# Altium schematic sheet 93.HW_ID.SchDoc
size 297 x 209 mm; Revision: V2.1; Schematic Page Number: 11; Page Number: 40; Check: Default; Schematic Name: RK_NVR_DEMO1_RK3588_LP4/4x_V21; Page Count: 43; Page name: 93.HW_ID; Designer: Zhangdz; Schematic Page Count: 99; Revcode: V2.1; DsnPath: E:\Work\SBER\RK3588_SOM\temp\RK_NVR_DEMO1_RK3588_LP4XD200P232SD8_V21_20211228.DSN; SchematicName: RK_NVR_DEMO1_RK3588_LP4/4x_V21; PageName: 93.HW_ID; PageSize: A4; TopSchematic: True
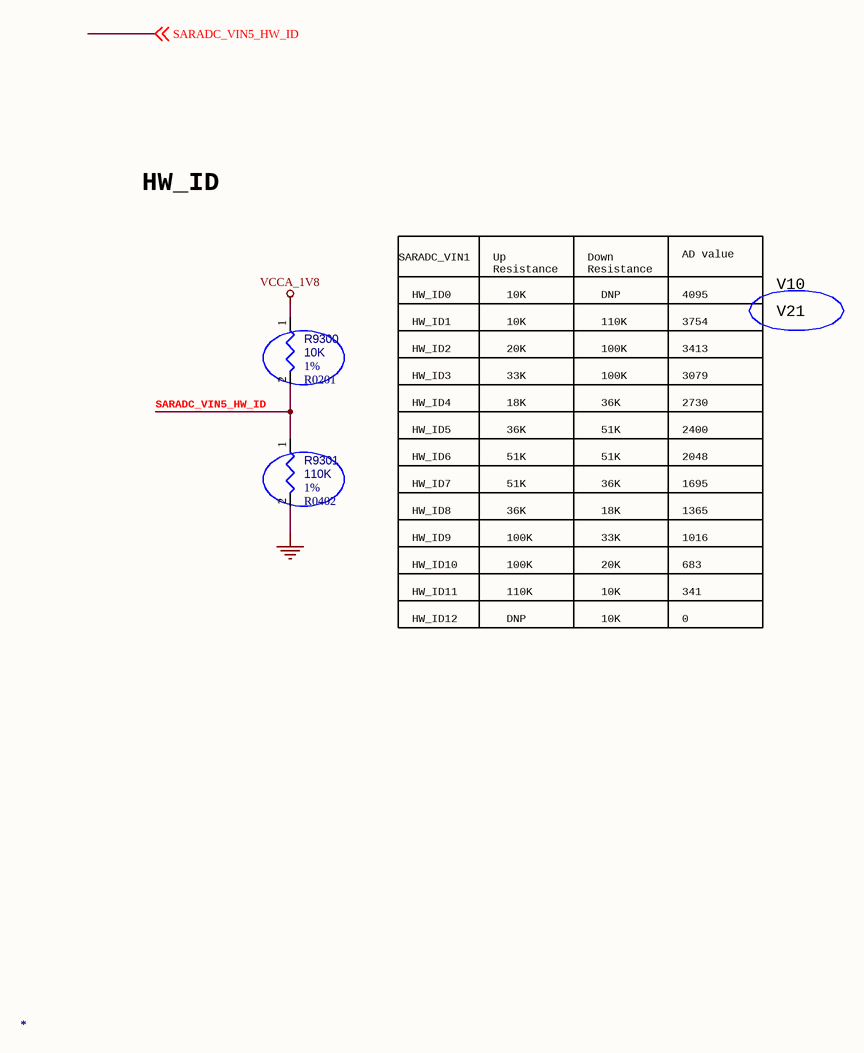
[diagram p0: 93.HW_ID.SchDoc]

## Parts
R9300  *  PCB Footprint: R0201  Tolerance: 1%  [R0402]
R9301  *  Tolerance: 1%  [R0402]

## Nets
GND: R9301.2
VCCA_1V8: R9300.1
SARADC_VIN5_HW_ID: R9300.2 R9301.1 ; off-sheet SARADC_VIN5_HW_ID

## Notes on the sheet
- HW_ID
- SARADC_VIN1
- HW_ID0
- Up
  Resistance
- 10K
- Down
  Resistance
- DNP
- AD value
- 4095
- V10
- V21
- HW_ID1
- HW_ID2
- HW_ID3
- 20K
- 33K
- 110K
- 100K
- 3413
- 3079
- 3754
- HW_ID4
- HW_ID5
- 18K
- 36K
- 51K
- 2730
- 2400
- HW_ID8
- HW_ID7
- HW_ID6
- 2048
- 1695
- 1365
- HW_ID10
- HW_ID9
- 1016
- 683
- HW_ID11
- HW_ID12
- 341
- 0

## Library data of the parts
R9300 = RESISTOR_Dup1: НЁУГєсД¤µзЧи,10K,+/-1%,R0201,1/20W.; Part Reference: R9300; Manufacturer PN: RC0201FR-0710KL; Manufacturer: YAGEO; Wattage: 1/20W; Priority: A; Value: 10K; Created by: YTL; Part Type: НЁУГєсД¤µзЧи; RK PN: RC0201FR-0710KL
R9301 = RESISTOR_Dup1: НЁУГєсД¤µзЧи,110K,+/-1%,R0402,1/16W.; Part Reference: R9301; Manufacturer PN: RC0402FR-07110KL; Manufacturer: YAGEO; Wattage: 1/16W; Priority: A; PCB Footprint: R0402; Value: 110K; Created by: YTL; Part Type: НЁУГєсД¤µзЧи; RK PN: RC0402FR-07110KL